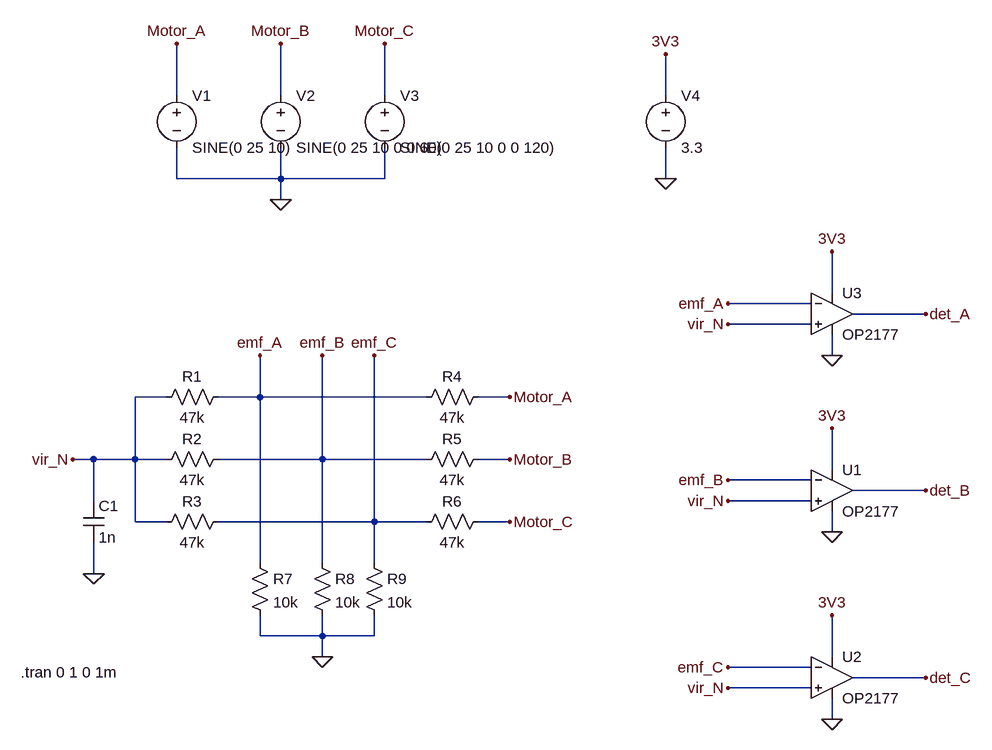
[diagram p0: schematic BEMF.asc]
BEMF.asc, the LTspice schematic file:
Version 4
SHEET 1 1616 680
WIRE 32 -352 32 -432
WIRE 192 -352 192 -432
WIRE 352 -352 352 -432
WIRE 784 -352 784 -416
WIRE 32 -224 32 -272
WIRE 192 -224 192 -272
WIRE 192 -224 32 -224
WIRE 352 -224 352 -272
WIRE 352 -224 192 -224
WIRE 784 -224 784 -272
WIRE 192 -192 192 -224
WIRE 1040 -48 1040 -112
WIRE 1008 -32 880 -32
WIRE 1184 -16 1072 -16
WIRE 1008 0 880 0
WIRE 1040 48 1040 16
WIRE 16 112 -32 112
WIRE 160 112 160 48
WIRE 160 112 96 112
WIRE 416 112 160 112
WIRE 544 112 496 112
WIRE -96 208 -128 208
WIRE -32 208 -32 112
WIRE -32 208 -96 208
WIRE 16 208 -32 208
WIRE 256 208 256 48
WIRE 256 208 96 208
WIRE 416 208 256 208
WIRE 544 208 496 208
WIRE 1040 224 1040 160
WIRE 1008 240 880 240
WIRE 1184 256 1072 256
WIRE -96 272 -96 208
WIRE 1008 272 880 272
WIRE -32 304 -32 208
WIRE 16 304 -32 304
WIRE 336 304 336 48
WIRE 336 304 96 304
WIRE 416 304 336 304
WIRE 544 304 496 304
WIRE 1040 320 1040 288
WIRE 160 368 160 112
WIRE 256 368 256 208
WIRE 336 368 336 304
WIRE -96 384 -96 336
WIRE 160 480 160 448
WIRE 256 480 256 448
WIRE 256 480 160 480
WIRE 336 480 336 448
WIRE 336 480 256 480
WIRE 256 512 256 480
WIRE 1040 512 1040 448
WIRE 1008 528 880 528
WIRE 1184 544 1072 544
WIRE 1008 560 880 560
WIRE 1040 608 1040 576
FLAG 256 512 0
FLAG -128 208 vir_N
FLAG -96 384 0
FLAG 544 112 Motor_A
FLAG 544 208 Motor_B
FLAG 544 304 Motor_C
FLAG 160 48 emf_A
FLAG 256 48 emf_B
FLAG 336 48 emf_C
FLAG 192 -192 0
FLAG 32 -432 Motor_A
FLAG 192 -432 Motor_B
FLAG 352 -432 Motor_C
FLAG 1040 48 0
FLAG 784 -224 0
FLAG 784 -416 3V3
FLAG 1040 -112 3V3
FLAG 880 0 vir_N
FLAG 1040 320 0
FLAG 1040 160 3V3
FLAG 880 272 vir_N
FLAG 1040 608 0
FLAG 1040 448 3V3
FLAG 880 560 vir_N
FLAG 880 -32 emf_A
FLAG 880 240 emf_B
FLAG 880 528 emf_C
FLAG 1184 -16 det_A
FLAG 1184 256 det_B
FLAG 1184 544 det_C
SYMBOL res 112 96 R90
WINDOW 0 0 56 VBottom 2
WINDOW 3 32 56 VTop 2
SYMATTR InstName R1
SYMATTR Value 47k
SYMBOL res 112 192 R90
WINDOW 0 0 56 VBottom 2
WINDOW 3 32 56 VTop 2
SYMATTR InstName R2
SYMATTR Value 47k
SYMBOL res 112 288 R90
WINDOW 0 0 56 VBottom 2
WINDOW 3 32 56 VTop 2
SYMATTR InstName R3
SYMATTR Value 47k
SYMBOL res 512 96 R90
WINDOW 0 0 56 VBottom 2
WINDOW 3 32 56 VTop 2
SYMATTR InstName R4
SYMATTR Value 47k
SYMBOL res 512 192 R90
WINDOW 0 0 56 VBottom 2
WINDOW 3 32 56 VTop 2
SYMATTR InstName R5
SYMATTR Value 47k
SYMBOL res 512 288 R90
WINDOW 0 0 56 VBottom 2
WINDOW 3 32 56 VTop 2
SYMATTR InstName R6
SYMATTR Value 47k
SYMBOL res 144 352 R0
SYMATTR InstName R7
SYMATTR Value 10k
SYMBOL res 240 352 R0
SYMATTR InstName R8
SYMATTR Value 10k
SYMBOL res 320 352 R0
SYMATTR InstName R9
SYMATTR Value 10k
SYMBOL cap -112 272 R0
SYMATTR InstName C1
SYMATTR Value 1n
SYMBOL voltage 32 -368 R0
WINDOW 123 0 0 Left 0
WINDOW 39 0 0 Left 0
SYMATTR InstName V1
SYMATTR Value SINE(0 25 10)
SYMBOL voltage 192 -368 R0
WINDOW 123 0 0 Left 0
WINDOW 39 0 0 Left 0
SYMATTR InstName V2
SYMATTR Value SINE(0 25 10 0 0 60)
SYMBOL voltage 352 -368 R0
WINDOW 123 0 0 Left 0
WINDOW 39 0 0 Left 0
SYMATTR InstName V3
SYMATTR Value SINE(0 25 10 0 0 120)
SYMBOL voltage 784 -368 R0
WINDOW 123 0 0 Left 0
WINDOW 39 0 0 Left 0
SYMATTR InstName V4
SYMATTR Value 3.3
SYMBOL OpAmps\\OP2177 1040 -80 R0
SYMATTR InstName U3
SYMBOL OpAmps\\OP2177 1040 192 R0
SYMATTR InstName U1
SYMBOL OpAmps\\OP2177 1040 480 R0
SYMATTR InstName U2
TEXT -208 536 Left 2 !.tran 0 1 0 1m

The netlist it stands for:
* BEMF.asc
R1 emf_A vir_N 47k
R2 emf_B vir_N 47k
R3 emf_C vir_N 47k
R4 Motor_A emf_A 47k
R5 Motor_B emf_B 47k
R6 Motor_C emf_C 47k
R7 emf_A 0 10k
R8 emf_B 0 10k
R9 emf_C 0 10k
C1 vir_N 0 1n
V1 Motor_A 0 SINE(0 25 10)
V2 Motor_B 0 SINE(0 25 10 0 0 60)
V3 Motor_C 0 SINE(0 25 10 0 0 120)
V4 3V3 0 3.3
XU3 vir_N emf_A 3V3 0 det_A OP2177  ; pins In+ In- V+ V- OUT
XU1 vir_N emf_B 3V3 0 det_B OP2177  ; pins In+ In- V+ V- OUT
XU2 vir_N emf_C 3V3 0 det_C OP2177  ; pins In+ In- V+ V- OUT
.tran 0 1 0 1m
.backanno
.end